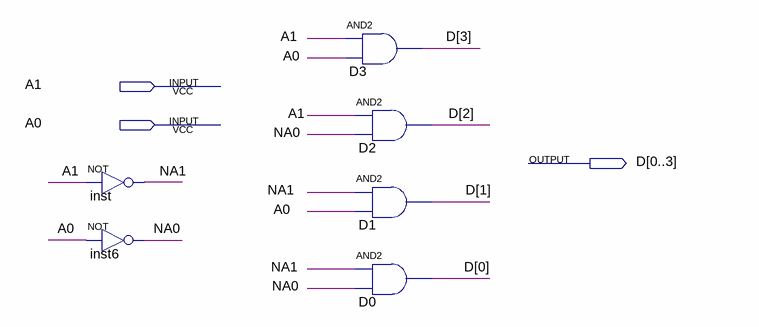
[diagram p0: schematic sheet]
// Quartus schematic Decodificador2_4.bdf as structural Verilog: 6 symbols, 3 pins
module Decodificador2_4 (
  input  A1,
  input  A0,
  output [0:3] D
);

  wire NA0, NA1;

  not inst (NA1, A1);
  not inst6 (NA0, A0);
  and D3 (D[3], A1, A0);
  and D2 (D[2], A1, NA0);
  and D1 (D[1], NA1, A0);
  and D0 (D[0], NA1, NA0);
endmodule
